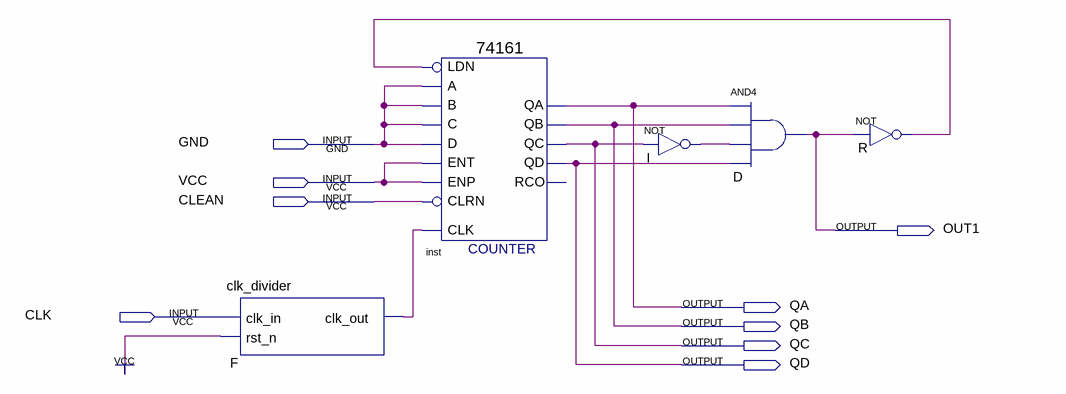
[diagram p0: schematic sheet]
// Quartus schematic Cnt12DI.bdf as structural Verilog: 5 symbols, 9 pins
module Cnt12DI (
  input  GND,
  input  VCC,
  input  CLEAN,
  input  CLK,
  output OUT1,
  output QA,
  output QB,
  output QC,
  output QD
);

  wire F_clk_out, I_out, R_out;

  clk_divider F (.clk_in(CLK), .rst_n(1'b1), .clk_out(F_clk_out));
  \74161  inst (
    .CLRN(CLEAN), .CLK(F_clk_out), .ENP(VCC), .LDN(R_out), .A(GND), .D(GND), .ENT(VCC), .B(GND), .C(GND),
    .QD(QD), .QC(QC), .QB(QB), .QA(QA));  // open: RCO
  not I (I_out, QC);
  and D (OUT1, QA, QB, I_out, QD);
  not R (R_out, OUT1);
endmodule
